# EAGLE schematic statuspanel (EAGLE 9.6.2)
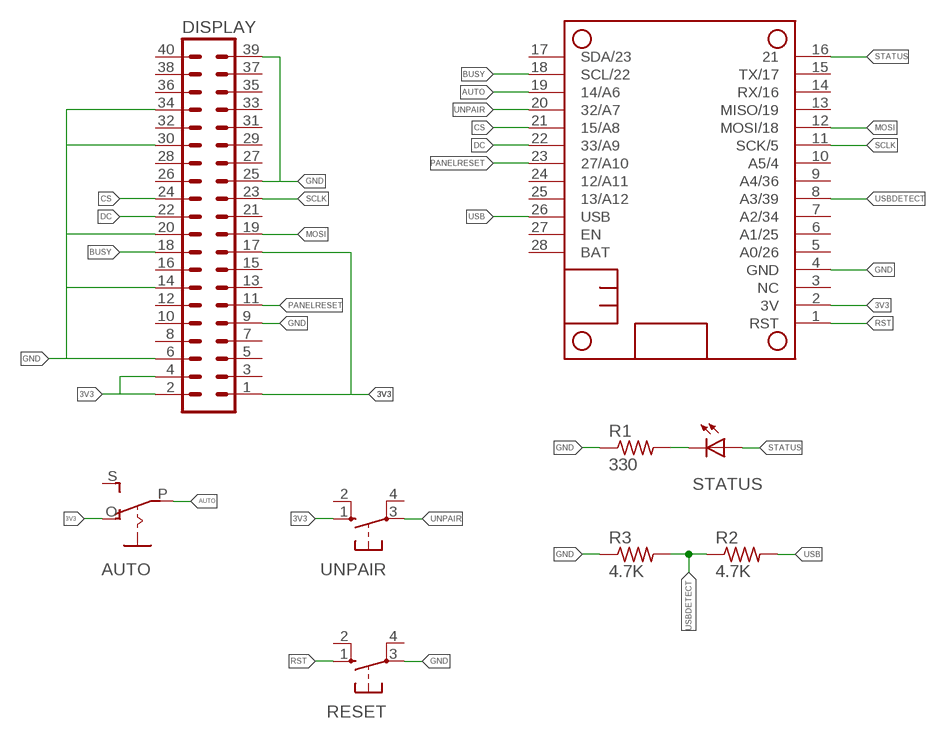
[diagram p0: schematic, sheet 1]

## Parts
AUTO  EG1218S  [EG1218]
DISPLAY  MA20-2  [MA20-2]
HUZZAH32  HUZZAH32_NODIM  [FEATHERWING_DIM]
R1  330  R-US_R0805  [R0805]
R2  4.7K  R-US_R0805  [R0805]
R3  4.7K  R-US_R0805  [R0805]
RESET  10-XX  [B3F-10XX]
STATUS  LED3MM  [LED3MM]
UNPAIR  10-XX  [B3F-10XX]

## Nets
3V3: AUTO.O DISPLAY.1 DISPLAY.2 DISPLAY.4 DISPLAY.17 HUZZAH32.2(3V) UNPAIR.1(S)
AUTO: AUTO.P HUZZAH32.19(14/A6)
BUSY: DISPLAY.18 HUZZAH32.18(SCL/22)
CS: DISPLAY.24 HUZZAH32.21(15/A8)
DC: DISPLAY.22 HUZZAH32.22(33/A9)
GND: DISPLAY.6 DISPLAY.9 DISPLAY.14 DISPLAY.20 DISPLAY.25 DISPLAY.30 DISPLAY.34 DISPLAY.39 HUZZAH32.4(GND) R1.1 R3.1 RESET.3(P)
MOSI: DISPLAY.19 HUZZAH32.12(MOSI/18)
N$3: R1.2 STATUS.K(C)
PANELRESET: DISPLAY.11 HUZZAH32.23(27/A10)
RST: HUZZAH32.1(RST) RESET.1(S)
SCLK: DISPLAY.23 HUZZAH32.11(SCK/5)
STATUS: HUZZAH32.16 STATUS.A
UNPAIR: HUZZAH32.20(32/A7) UNPAIR.3(P)
USB: HUZZAH32.26(USB) R2.2
USBDETECT: HUZZAH32.8(A3/39) R2.1 R3.2
Unconnected: AUTO.S DISPLAY.3 DISPLAY.5 DISPLAY.7 DISPLAY.8 DISPLAY.10 DISPLAY.12 DISPLAY.13 DISPLAY.15 DISPLAY.16 DISPLAY.21 DISPLAY.26 DISPLAY.27 DISPLAY.28 DISPLAY.29 DISPLAY.31 DISPLAY.32 DISPLAY.33 DISPLAY.35 DISPLAY.36 DISPLAY.37 DISPLAY.38 DISPLAY.40 HUZZAH32.3(NC) HUZZAH32.5(A0/26) HUZZAH32.6(A1/25) HUZZAH32.7(A2/34) HUZZAH32.9(A4/36) HUZZAH32.10(A5/4) HUZZAH32.13(MISO/19) HUZZAH32.14(RX/16) HUZZAH32.15(TX/17) HUZZAH32.17(SDA/23) HUZZAH32.24(12/A11) HUZZAH32.25(13/A12) HUZZAH32.27(EN) HUZZAH32.28(BAT) RESET.2(S1) RESET.4(P1) UNPAIR.2(S1) UNPAIR.4(P1)

## Library data of the parts
AUTO = adafruit:EG1218: SLIDING SWITCH 0.1" spacing through hole, vertical SPDT slide switch http://www.ladyada.net/library/pcb/eaglelibrary.html
DISPLAY = con-lstb:MA20-2: PIN HEADER; OC_FARNELL: unknown; OC_NEWARK: unknown
HUZZAH32 = tomscis_huzzah32:HUZZAH32
R1-R3 = adafruit:R-US_: RESISTOR, American symbol
RESET UNPAIR = switch-omron:10-XX: OMRON SWITCH; MPN: B3F-1000; OC_FARNELL: 176432; OC_NEWARK: 36M3542
STATUS = adafruit:LED: LED OSRAM: - CHIPLED LG R971, LG N971, LY N971, LG Q971, LY Q971, LO R971, LY R971 LH N974, LH R974 LS Q976, LO Q976, LY Q976 LO Q996 - Hyper CHIPLED LW Q18S LB Q993, LB Q99A, LB R99A - SideLED LS A670, LO A670, LY A670, LG A670, LP A670 LB A673, LV A673, LT A673, LW A673 LH A674 LY A675 LS A676, LA A676, LO A676, LY A676, LW A676 LS A679, LY A679, LG A679 - Hyper Micro SIDELED® LS Y876, LA Y876, LO Y876, LY Y876 LT Y87S - SmartLED LW L88C, LW L88S LB L89C, LB L89S, LG L890 LS L89K, LO L89K, LY L89K LS L896, LA L896, LO L896, LY L896 - TOPLED LS T670, LO T670, LY T670, LG T670, LP T670 LSG T670, LSP T670, LSY T670, LOP T670, LYG T670 LG T671, LOG T671, LSG T671 LB T673, LV T673, LT T673, LW T673 LH T674 LS T676, LA T676, LO T676, LY T676, LB T676, LH T676, LSB T676, LW T676 LB T67C, LV T67C, LT T67C, LS T67K, LO T67K, LY T67K, LW E67C LS E67B, LA E67B, LO E67B, LY E67B, LB E67C, LV E67C, LT E67C LW T67C LS T679, LY T679, LG T679 LS T770, LO T770, LY T770, LG T770, LP T770 LB T773, LV T773, LT T773, LW T773 LH T774 LS E675, LA E675, LY E675, LS T675 LS T776, LA T776, LO T776, LY T776, LB T776 LHGB T686 LT T68C, LB T68C - Hyper Mini TOPLED® LB M676 - Mini TOPLED Santana® LG M470 LS M47K, LO M47K, LY M47K Source: http://www.osram.convergy.de/